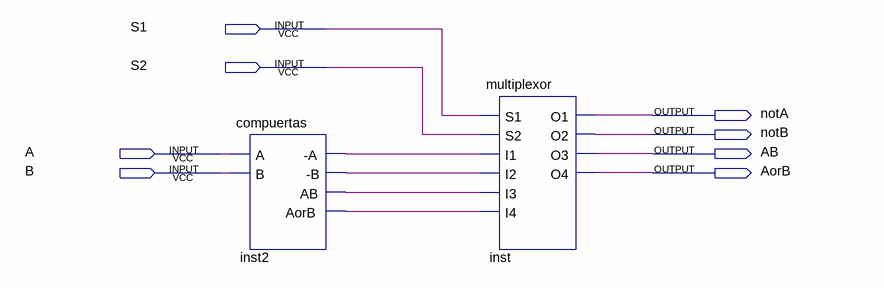
[diagram p0: schematic sheet]
// Quartus schematic encapsulamiento.bdf as structural Verilog: 2 symbols, 8 pins
module encapsulamiento (
  input  S1,
  input  S2,
  input  A,
  input  B,
  output notA,
  output notB,
  output AB,
  output AorB
);

  wire inst2__a, inst2__b, inst2_ab, inst2_aorb;

  compuertas inst2 (.A(A), .B(B), .\-A (inst2__a), .\-B (inst2__b), .AB(inst2_ab), .AorB(inst2_aorb));
  multiplexor inst (
    .S1(S1), .S2(S2), .I1(inst2__a), .I2(inst2__b), .I3(inst2_ab), .I4(inst2_aorb), .O1(notA), .O2(notB),
    .O3(AB), .O4(AorB));
endmodule
